# EAGLE design Startgate Controller-Daughterboard (EAGLE 7.7.0)
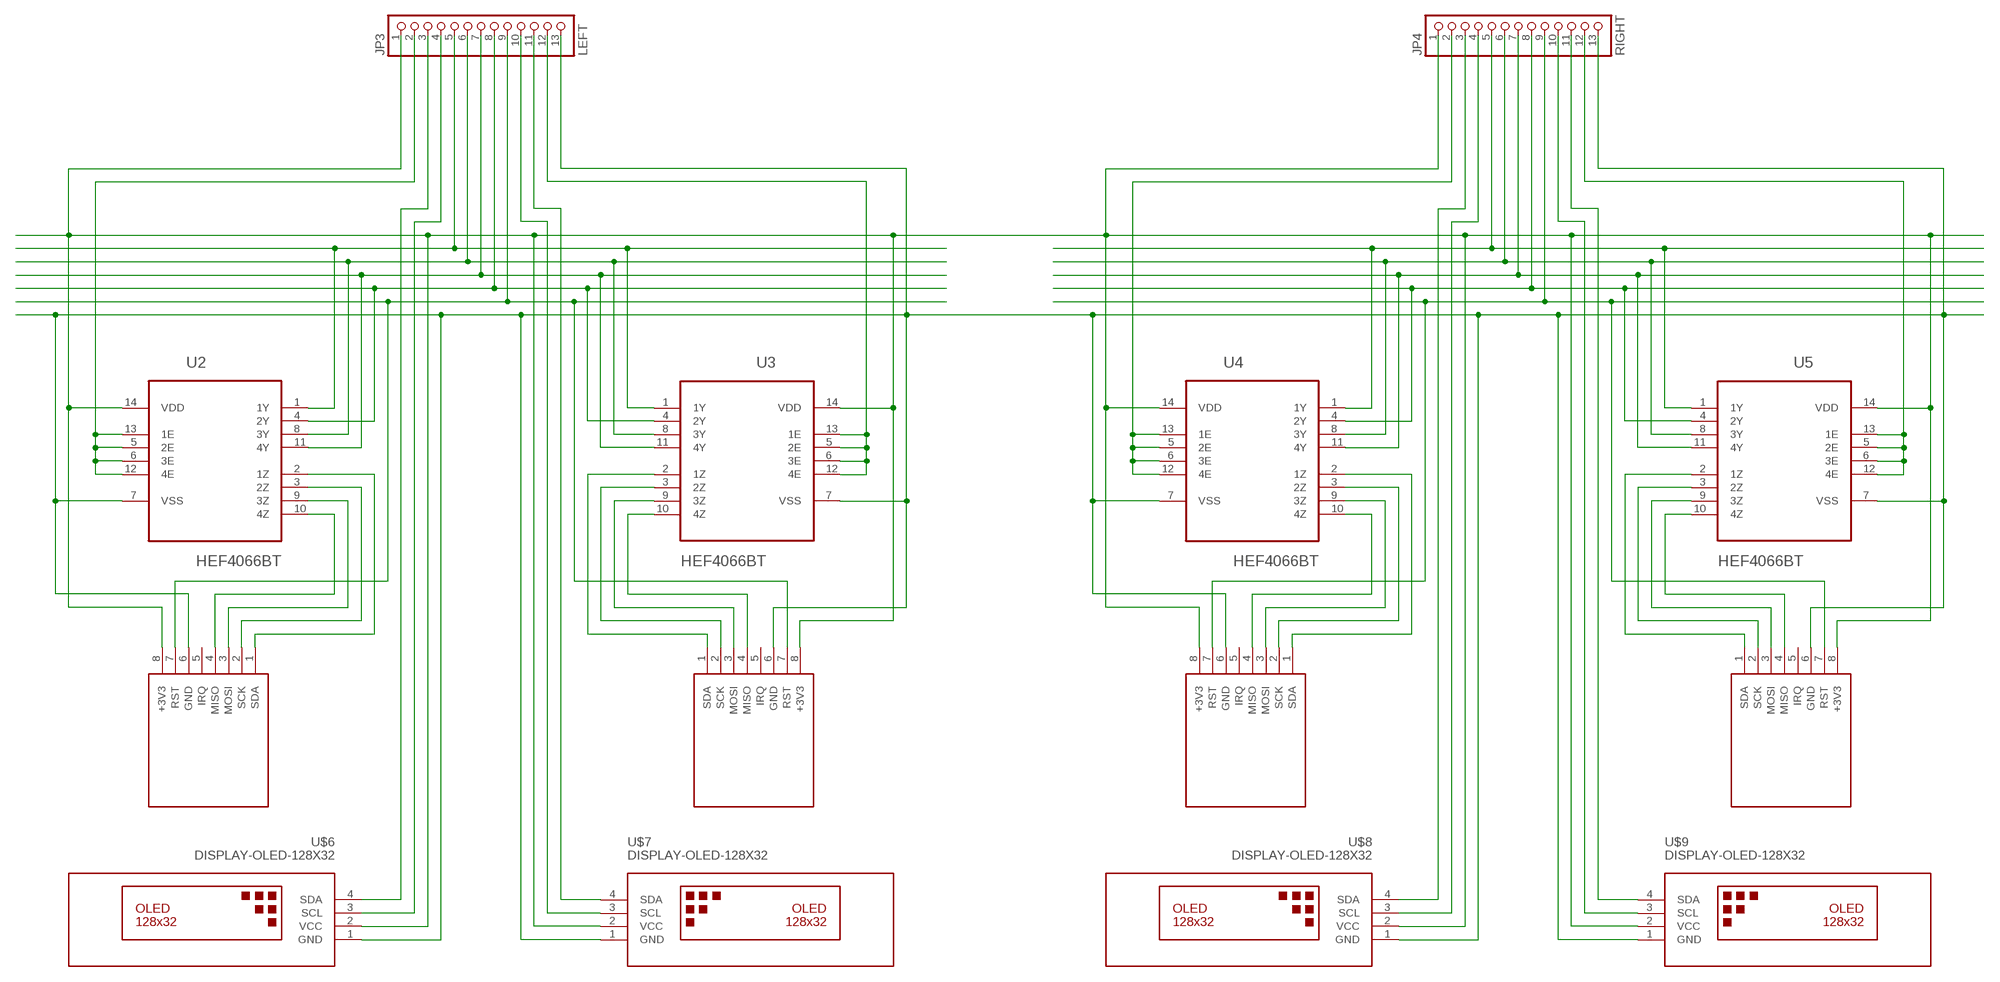
[diagram p0: schematic, sheet 1]

## Parts
JP3  LEFT  PINHD-1X13  [1X13]
JP4  RIGHT  PINHD-1X13  [1X13]
U2  HEF4066BT  [SOIC127P600X175-14N]
U3  HEF4066BT  [SOIC127P600X175-14N]
U4  HEF4066BT  [SOIC127P600X175-14N]
U5  HEF4066BT  [SOIC127P600X175-14N]
U$2  RFID-RC522  [RFID-RC522]
U$3  RFID-RC522  [RFID-RC522]
U$4  RFID-RC522  [RFID-RC522]
U$5  RFID-RC522  [RFID-RC522]
U$6  DISPLAY-OLED-128X32  [DISPLAY-OLED-128X32]
U$7  DISPLAY-OLED-128X32  [DISPLAY-OLED-128X32]
U$8  DISPLAY-OLED-128X32  [DISPLAY-OLED-128X32]
U$9  DISPLAY-OLED-128X32  [DISPLAY-OLED-128X32]

## Nets
+3V3: JP3.1 JP4.1 U2.14(VDD) U3.14(VDD) U4.14(VDD) U5.14(VDD) U$2.8(+3V3) U$3.8(+3V3) U$4.8(+3V3) U$5.8(+3V3) U$6.2(VCC) U$7.2(VCC) U$8.2(VCC) U$9.2(VCC)
ENA1: JP3.2 U2.5(2E) U2.6(3E) U2.12(4E) U2.13(1E)
ENA2: JP3.12 U3.5(2E) U3.6(3E) U3.12(4E) U3.13(1E)
ENA3: JP4.2 U4.5(2E) U4.6(3E) U4.12(4E) U4.13(1E)
GND: JP3.13 JP4.13 U2.7(VSS) U3.7(VSS) U4.7(VSS) U5.7(VSS) U$2.6(GND) U$3.6(GND) U$4.6(GND) U$5.6(GND) U$6.1(GND) U$7.1(GND) U$8.1(GND) U$9.1(GND)
MISO: JP4.7 U4.11(4Y) U5.11(4Y)
MISO-OUT1: U2.10(4Z) U$2.4(MISO)
MISO-OUT2: U3.10(4Z) U$3.4(MISO)
MISO-OUT3: U4.10(4Z) U$4.4(MISO)
MISO-OUT4: U5.10(4Z) U$5.4(MISO)
MOSI: JP4.6 U4.8(3Y) U5.8(3Y)
MOSI-OUT1: U2.9(3Z) U$2.3(MOSI)
MOSI-OUT2: U3.9(3Z) U$3.3(MOSI)
MOSI-OUT3: U4.9(3Z) U$4.3(MOSI)
MOSI-OUT4: U5.9(3Z) U$5.3(MOSI)
N$3: JP3.6 U2.8(3Y) U3.8(3Y)
N$7: JP3.5 U2.1(1Y) U3.1(1Y)
N$8: JP3.7 U2.11(4Y) U3.11(4Y)
N$14: JP3.8 U2.4(2Y) U3.4(2Y)
N$16: JP3.9 U$2.7(RST) U$3.7(RST)
N$41: JP4.12 U5.5(2E) U5.6(3E) U5.12(4E) U5.13(1E)
RST: JP4.9 U$4.7(RST) U$5.7(RST)
SCK: JP4.8 U4.4(2Y) U5.4(2Y)
SCK-OUT1: U2.3(2Z) U$2.2(SCK)
SCK-OUT2: U3.3(2Z) U$3.2(SCK)
SCK-OUT3: U4.3(2Z) U$4.2(SCK)
SCK-OUT4: U5.3(2Z) U$5.2(SCK)
SCL1: JP3.4 U$6.3(SCL)
SCL2: JP3.10 U$7.3(SCL)
SCL3: JP4.4 U$8.3(SCL)
SCL4: JP4.10 U$9.3(SCL)
SDA1: JP3.3 U$6.4(SDA)
SDA2: JP3.11 U$7.4(SDA)
SDA3: JP4.3 U$8.4(SDA)
SDA4: JP4.11 U$9.4(SDA)
SS: JP4.5 U4.1(1Y) U5.1(1Y)
SS-OUT1: U2.2(1Z) U$2.1(SDA)
SS-OUT2: U3.2(1Z) U$3.1(SDA)
SS-OUT3: U4.2(1Z) U$4.1(SDA)
SS-OUT4: U5.2(1Z) U$5.1(SDA)
Unconnected: U$2.5(IRQ) U$3.5(IRQ) U$4.5(IRQ) U$5.5(IRQ)

## Library data of the parts
JP3 JP4 = pinhead:PINHD-1X13: PIN HEADER
U2-U5 = NXP_By_element14_Batch_1:HEF4066BT: Quad single-pole single-throw analog switch; MPN: HEF4066BT; OC_FARNELL: 1085287; OC_NEWARK: 97K1294; PACKAGE: SOIC-14; SUPPLIER: NXP
U$2-U$5 = miro:RFID-RC522: RC522 is a simple, low cost RFID reader module.
U$6-U$9 = diy-modules:DISPLAY-OLED-128X32: 128x32 Dot Matrix OLED Module with I2C interface based on SSD1306 chip More details available here: http://www.tinyosshop.com/index.php?route=product/product&product_id=953 Schematic available here: http://www.tinyosshop.com/datasheet/OLED%2012832.pdf SSD1306 datasheet: https://cdn-shop.adafruit.com/datasheets/SSD1306.pdf Click here to find device on ebay.com <http://www.ebay.com/sch/oled+display+128x32+i2c>

## Board
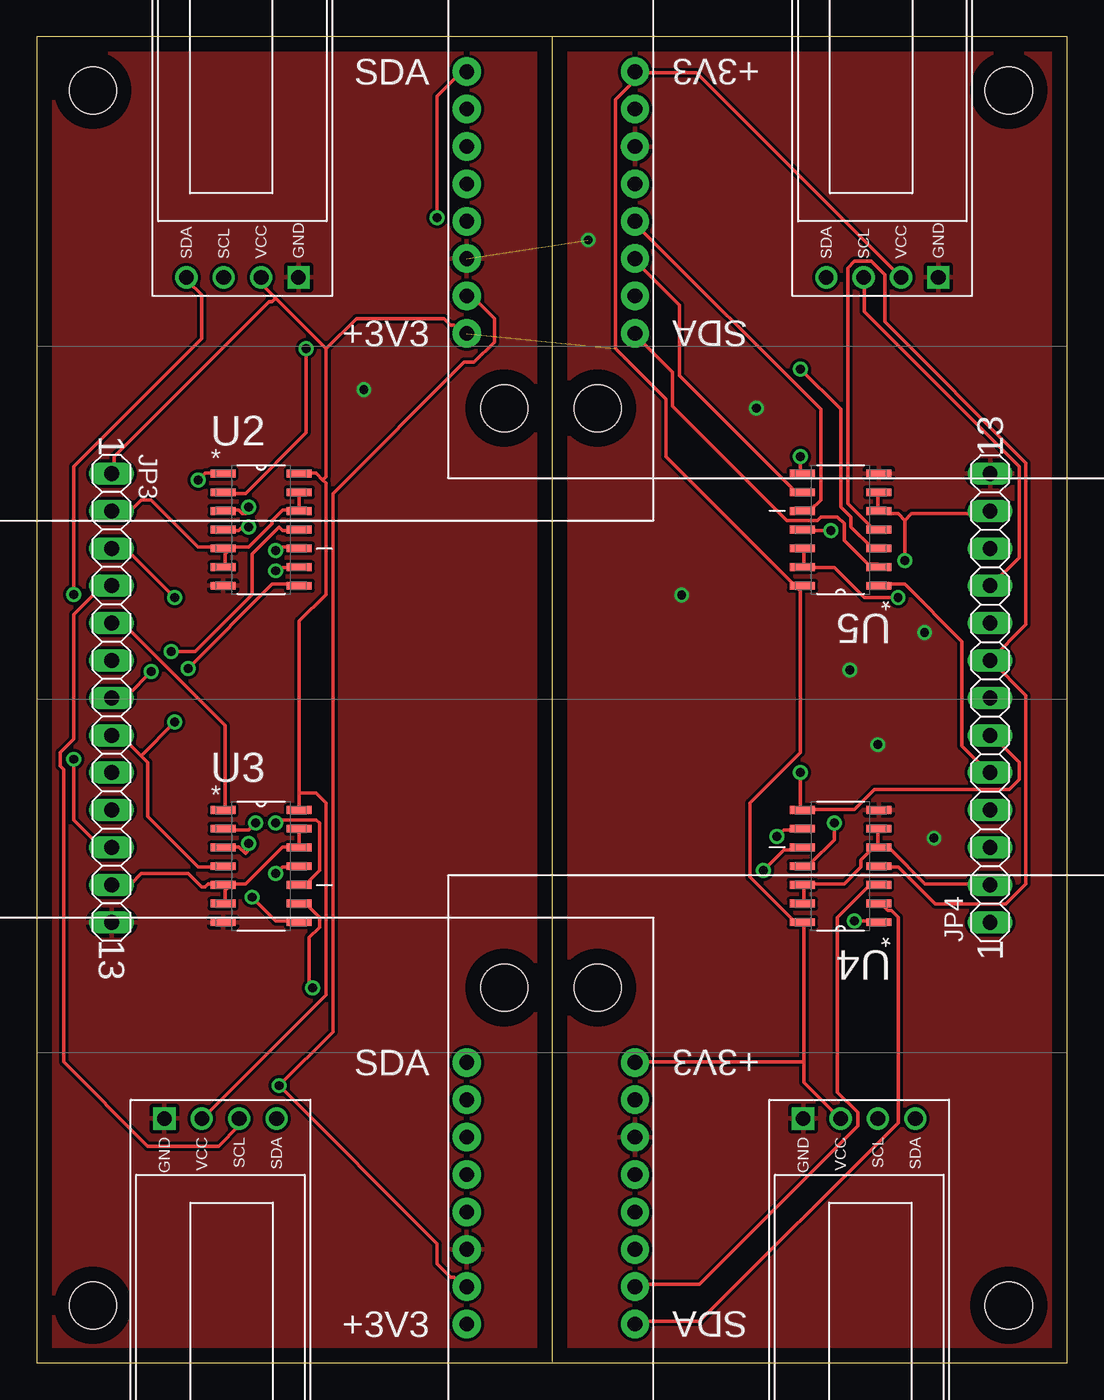
[diagram p1: board, top side]
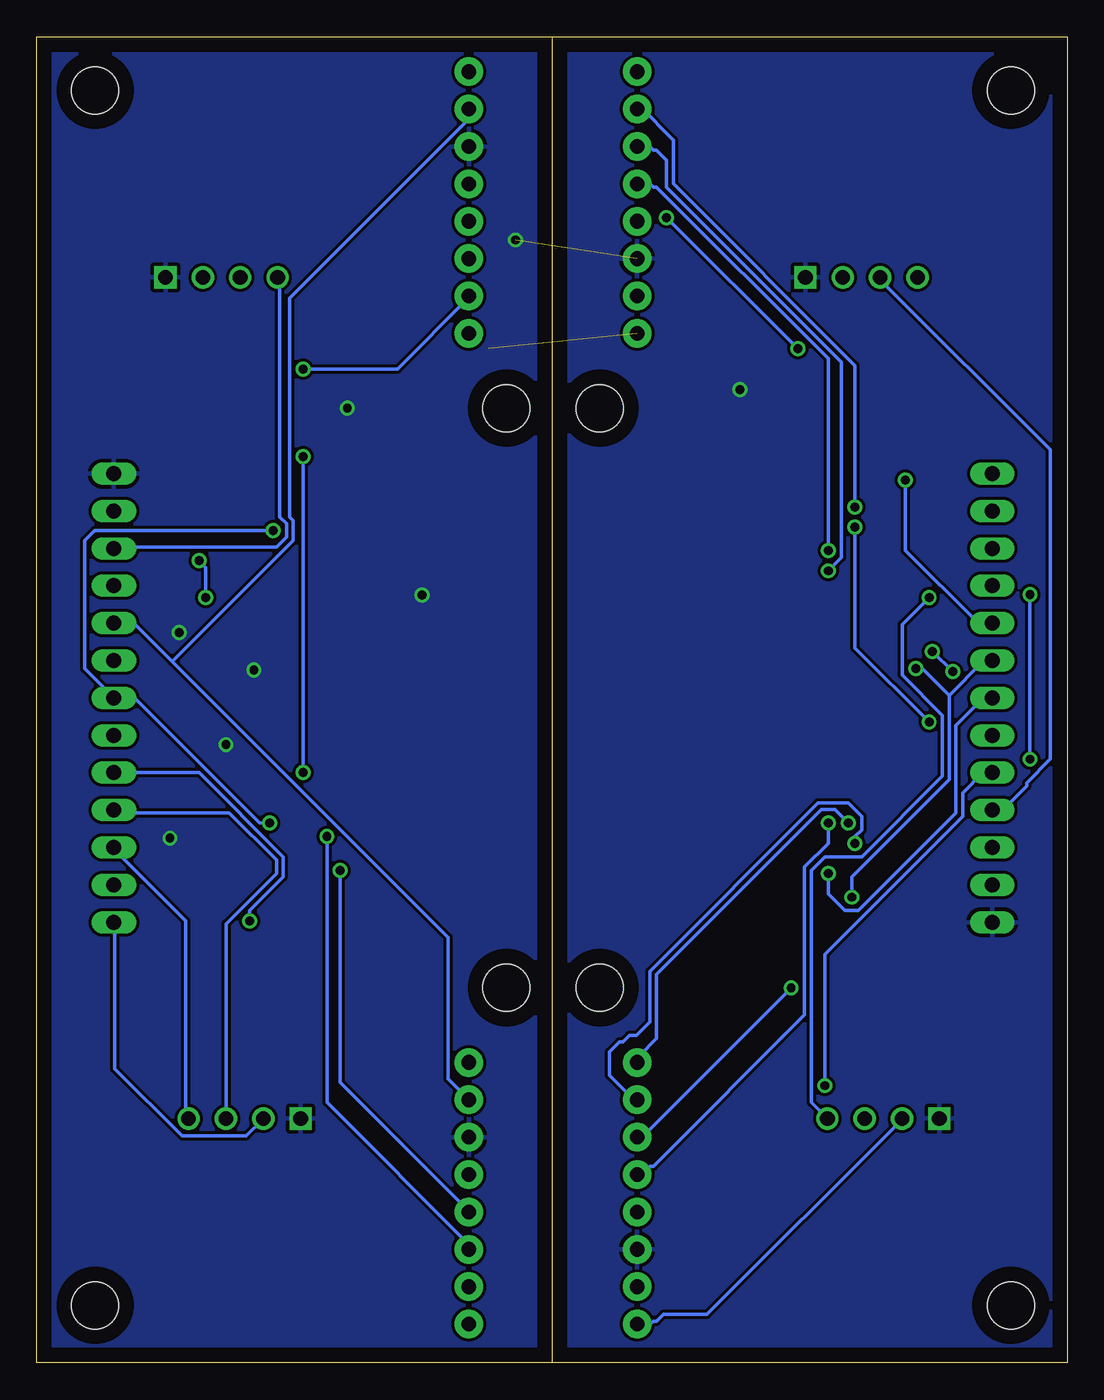
[diagram p2: board, bottom side, seen from below]

Size 70 x 90.08 mm. Coordinates in mm from the lower left corner, seen from the top.
Outline: 35,90.08 35,0.08
Outline: 0,0 70,0 70,90.08 0,90.08 0,0
Copper layers (1*16): Top 0.035mm / dielectric 1.5mm / Bottom 0.035mm
Design rules "default": minimum track width 10mil, minimum drill 24mil, track to track 8mil, track to pad 8mil, pad to pad 8mil, via to via 8mil, smd to smd 8mil, copper to edge 40mil, drill to drill 8mil, minimum pad ring 10mil, minimum via ring 8mil, stop-mask expansion 4mil, vias tented up to drill 0mil, thermal gap 10mil
Holes 3.2 mm at 31.75,64.85 31.75,25.48 3.81,3.89 3.81,86.44 66.04,86.44 38.1,64.85 38.1,25.48 66.04,3.89

### Footprints (pad centres in the part's own frame; a part is rotated, then mirrored left to right if it is on the bottom)
1X13 = drill 1.016 long: 1 -15.24,0; 2 -12.7,0; 3 -10.16,0; 4 -7.62,0; 5 -5.08,0; 6 -2.54,0; 7 0,0; 8 2.54,0; 9 5.08,0; 10 7.62,0; 11 10.16,0; 12 12.7,0; 13 15.24,0
SOIC127P600X175-14N = smd 1.702 x 0.533: 1 -2.591,3.81; 2 -2.591,2.54; 3 -2.591,1.27; 4 -2.591,0; 5 -2.591,-1.27; 6 -2.591,-2.54; 7 -2.591,-3.81; 8 2.591,-3.81; 9 2.591,-2.54; 10 2.591,-1.27; 11 2.591,0; 12 2.591,1.27; 13 2.591,2.54; 14 2.591,3.81
RFID-RC522 = drill 1 pad 1.93: 1 12.7,1.27; 2 15.24,1.27; 3 17.78,1.27; 4 20.32,1.27; 5 22.86,1.27; 6 25.4,1.27; 7 27.94,1.27; 8 30.48,1.27
DISPLAY-OLED-128X32 = drill 1 square: 1 -17.78,-3.81 | drill 1: 2 -17.78,-1.27; 3 -17.78,1.27; 4 -17.78,3.81

### Placement (x,y rotation side)
JP3  5.08,45.16 270 top
JP4  64.77,45.16 90 top
U2  15.24,56.59 0 top
U3  15.24,33.73 0 top
U4  54.61,33.73 180 top
U5  54.61,56.59 180 top
U$2  27.94,100.41 270 top
U$3  27.94,33.1 270 top
U$4  41.91,-10.08 90 top
U$5  41.91,57.23 90 top
U$6  12.48,-1.19 270 top
U$7  13.97,91.52 90 top
U$8  55.88,-1.19 270 top
U$9  57.45,91.52 90 top

### Tracks (layer width: path | path; a pad name or v marks a point on that pad's centre or on a via)
+3V3  (1 unrouted)
  Top 0.254: 17.83,38.71 17.83,50.37 19.66,52.2 19.66,59.74 19.43,59.97 | 17.83,38.71 U3.14 | 19.43,59.97 18.97,60.43 17.83,60.43 U2.14 | 19.66,68.89 16.23,72.32 | 16.23,72.32 15.32,73.23 15.32,73.69 U$7.2 | 19.66,68.89 19.66,60.2 19.43,59.97 | 16.23,72.32 16,72.09 15.77,72.09 5.26,61.57 5.26,60.43 JP3.1 | 19.66,68.89 21.72,70.95 27.66,70.95 28.12,70.49 28.35,70.49 28.8,70.03 29.03,70.03 U$2.8 | 17.83,38.71 18.97,38.71 19.66,38.03 19.66,25 11.43,16.77 U$6.2 | U$9.2 58.52,73.92 44.81,87.63 40.69,87.63 U$5.8 40.46,87.63 40.46,86.95 39.32,85.8 39.32,68.89 42.75,65.46 42.75,61.57 51.89,52.43 | 52.12,20.42 52.12,19.05 54.41,16.77 U$8.2 | 52.12,20.42 52.12,29.8 U4.14 51.89,30.03 51.44,30.03 48.46,33 48.46,38.03 51.89,41.46 51.89,52.43 | 51.89,52.43 51.89,52.66 U5.14 | 52.12,20.42 40.69,20.42 U$4.8
  Bottom 0.254: U$6.2 11.43,16.54 11.43,16.31 24.46,3.28 27.43,3.28 27.89,2.82 28.12,2.82 28.35,2.6 29.03,2.6 U$3.8 | JP4.1 64.69,29.8 64.69,19.97 60.12,15.4 55.78,15.4 54.63,16.54 U$8.2
ENA1
  Top 0.254: 13.03,55.4 13.03,55.17 12.8,54.94 12.8,54.26 U2.6 | 13.03,55.4 12.8,55.4 U2.5 | 17.83,57.92 17.83,58.83 17.6,59.06 17.83,59.29 U2.13 | 13.03,55.4 14.4,55.4 16,57 16,57.23 16.69,57.92 17.83,57.92 | 13.03,55.4 U2.5 | 17.83,57.92 U2.12 | JP3.2 5.26,57.92 6.4,57.92 7.09,58.6 7.77,58.6 10.97,55.4 12.57,55.4 U2.5
ENA2
  Top 0.254: 13.03,32.54 13.03,32.31 12.8,32.08 12.8,31.4 U3.6 | 13.03,32.54 12.8,32.54 U3.5 | 17.83,35.06 17.83,35.97 17.6,36.2 17.83,36.43 U3.13 | 13.03,32.54 14.17,32.54 16.69,35.06 17.83,35.06 | 13.03,32.54 U3.5 | 17.83,35.06 U3.12 | JP3.12 5.26,32.54 6.4,32.54 7.09,33.23 10.29,33.23 11.2,32.31 11.43,32.31 11.66,32.54 12.57,32.54 U3.5
ENA3
  Top 0.254: U4.13 52.12,31.4 52.12,32.31 U4.12 52.12,32.54 54.86,32.54 56.01,33.68 56.01,34.14 57.15,35.28 | 57.15,35.28 57.15,36.2 U4.6 | 57.15,35.28 57.15,35.06 U4.5 57.38,34.83 58.06,34.83 60.35,32.54 64.69,32.54 JP4.2
GND  (via drill 0.6)  (1 unrouted)
  Top 0.254: 40.92,82.61 U$5.6
  other vias: 60.96,35.64 57.15,41.99 60.33,49.61 55.24,47.07 22.23,66.12 48.9,64.85 43.81,52.15 37.47,76.28
  pour Bottom: 0,90.25 69.85,90.25 69.85,-1.19 0,-1.19
  pour Top: 0,90.25 69.85,90.25 69.85,0.08 0,0.08
MISO  (via drill 0.61)
  Top 0.254: v54.18,36.66 54.18,35.51 52.58,33.91 52.12,33.91 U4.11 | v53.95,56.54 52.12,56.54 U5.11
  Bottom 0.254: v54.18,36.66 54.86,36.66 63.32,45.11 64.69,45.11 JP4.7 64.92,45.34 66.75,47.17 66.75,55.86 66.06,56.54 v53.95,56.54
MISO-OUT1  (via drill 0.61)
  Top 0.254: v16.23,55.17 16.46,55.4 17.83,55.4 U2.10
  Bottom 0.254: v16.23,55.17 16.23,68.2 27.89,79.86 28.12,79.86 28.35,80.09 U$2.4
MISO-OUT2  (via drill 0.61)
  Top 0.254: v16.23,36.66 16.46,36.88 18.97,36.88 19.2,36.66 19.2,33.46 18.29,32.54 17.83,32.54 U3.10
  Bottom 0.254: v16.23,36.66 16.23,35.28 17.83,33.68 17.83,23.63 28.12,13.34 28.35,13.34 29.03,12.65 U$3.4
MISO-OUT3  (via drill 0.61)
  Top 0.254: v49.38,33.46 50.75,34.83 51.89,34.83 U4.10
  Bottom 0.254: v49.38,33.46 49.38,19.05 40.69,10.37 U$4.4
MISO-OUT4
  Top 0.254: U5.10 52.12,57.92 52.58,57.92 53.26,58.6 53.26,64.77 40.69,77.35 U$5.4
MOSI  (via drill 0.61)
  Top 0.254: JP4.6 64.92,42.6 66.75,40.77 66.75,39.63 66.06,38.94 56.92,38.94 55.55,37.57 52.12,37.57 U4.8 51.89,37.57 v51.89,40.09 | v51.89,61.57 51.89,60.43 U5.8
  Bottom 0.254: v51.89,40.09 v51.89,61.57
MOSI-OUT1  (via drill 0.61)
  Top 0.254: v16.23,53.8 16.46,53.8 16.69,54.03 17.83,54.03 U2.9
  Bottom 0.254: v16.23,53.8 15.32,54.71 15.32,67.97 27.2,79.86 27.2,81.69 27.89,82.38 28.12,82.38 28.35,82.61 29.03,82.61 U$2.3
MOSI-OUT2  (via drill 0.61)
  Top 0.254: v18.75,25.45 18.52,25.68 18.52,28.88 19.2,29.57 19.2,30.25 18.29,31.17 17.83,31.17 U3.9
  Bottom 0.254: v18.75,25.45 29.03,15.17 U$3.3
MOSI-OUT3  (via drill 0.61)
  Top 0.254: v50.29,35.74 50.75,36.2 51.89,36.2 U4.9
  Bottom 0.254: v50.29,35.74 50.29,17.68 40.46,7.85 U$4.3
MOSI-OUT4
  Top 0.254: U5.9 51.89,59.29 51.44,59.29 43.66,67.06 43.66,71.86 40.69,74.83 U$5.3
N$3  (via drill 0.61)
  Top 0.254: v14.63,31.63 16.23,30.03 17.83,30.03 U3.8 | v10.29,47.17 16,52.89 17.83,52.89 U2.8
  Bottom 0.254: v14.63,31.63 14.63,33 8,39.63 8,45.34 | 8,45.34 5.71,47.63 5.26,47.63 JP3.6 | v10.29,47.17 9.83,47.17 8,45.34
N$7  (via drill 0.61)
  Top 0.254: U3.1 12.8,37.57 12.8,43.28 5.94,50.14 5.26,50.14 JP3.5 | v10.97,59.97 11.43,60.43 12.57,60.43 U2.1
  Bottom 0.254: v10.97,59.97 10.97,55.17 6.17,50.37 5.26,50.37 JP3.5
N$8  (via drill 0.61)
  Top 0.254: v16.23,33.23 16.69,33.68 17.83,33.68 U3.11 | v9.14,48.31 10.74,48.31 14.63,52.2 14.63,54.94 16.46,56.77 16.69,56.54 17.83,56.54 U2.11 | v7.77,46.94 6.17,45.34 5.26,45.34 JP3.7
  Bottom 0.254: v16.23,33.23 16.23,31.85 15.09,30.71 14.17,30.71 7.54,37.34 7.54,43.28 5.71,45.11 5.26,45.11 JP3.7 | v7.77,46.94 v9.14,48.31
N$14  (via drill 0.61)
  Top 0.254: 7.09,41.23 5.71,42.6 5.26,42.6 JP3.8 | 7.09,41.23 7.54,40.77 7.54,37.11 10.97,33.68 12.57,33.68 U3.4 | v14.4,56.77 14.17,57 13.72,56.54 12.8,56.54 U2.4 | 7.09,41.23 v9.37,43.51
  Bottom 0.254: v14.4,56.77 14.4,48.54 v9.37,43.51
N$16  (via drill 0.61)
  Top 0.254: U$3.7 29.03,5.11 28.35,5.79 28.12,5.79 27.2,6.71 27.2,8.08 v16.46,18.82 20.12,22.48 20.12,59.06 29.03,67.97 29.72,67.97 31.09,69.35 31.09,70.95 29.72,72.32 29.26,72.32 U$2.7
  Bottom 0.254: JP3.9 5.71,40.09 7.09,38.71 7.09,37.11 16.46,27.74 v16.46,18.82
N$41  (via drill 0.61)
  Top 0.254: U5.12 52.12,55.17 52.12,54.26 U5.13 52.12,54.03 54.18,54.03 56.24,51.97 v58.52,51.97 | U5.6 57.15,59.06 57.15,57.92 U5.5 57.38,57.69 58.52,57.69 58.98,57.23 | 58.98,57.23 v58.98,54.49 | 58.98,57.23 59.44,57.69 64.69,57.69 JP4.12
  Bottom 0.254: v58.52,51.97 58.52,54.03 v58.98,54.49
RST
  Bottom 0.254: 60.81,47.63 42.06,28.88 42.06,19.28 U$4.7 | 60.81,47.63 63.32,50.14 64.69,50.14 JP4.9 | 60.81,47.63 52.58,55.86 52.58,57.23 52.81,57.46 52.81,72.32 40.69,84.43 40.69,85.12 U$5.7
SCK
  Top 0.254: U4.4 57.38,33.68 58.52,33.68 61.04,31.17 65.84,31.17 67.21,32.54 67.21,45.34 64.92,47.63 JP4.8 67.21,50.14 67.21,61.12 57.61,70.72 57.61,73.92 56.69,74.83 55.55,74.83 55.09,74.38 55.09,58.37 56.69,56.77 57.15,56.77 U5.4
SCK-OUT1  (via drill 0.61)
  Top 0.254: v14.4,58.14 14.4,57.92 14.17,57.69 13.95,57.69 13.72,57.92 12.8,57.92 U2.3
  Bottom 0.254: v14.4,58.14 14.4,67.75 26.75,80.09 26.75,83.06 29.03,85.35 U$2.2
SCK-OUT2  (via drill 0.61)
  Top 0.254: v14.4,35.28 14.4,34.83 14.17,34.6 13.72,35.06 12.8,35.06 U3.3
  Bottom 0.254: v14.4,35.28 14.4,35.74 13.95,36.2 13.95,37.11 14.86,38.03 16.92,38.03 28.35,26.6 28.35,23.17 29.26,22.25 29.72,22.25 30.18,21.8 30.4,21.8 31.09,21.11 31.09,19.51 29.26,17.68 U$3.2
SCK-OUT3
  Top 0.254: U4.3 57.15,32.31 56.46,32.31 54.41,30.25 54.41,18.37 55.78,17 55.78,16.08 45.03,5.34 40.69,5.34 U$4.2
SCK-OUT4  (via drill 0.61)
  Top 0.254: v51.89,67.52 54.63,64.77 54.63,58.14 55.32,57.46 55.32,56.77 56.69,55.4 57.15,55.4 U5.3
  Bottom 0.254: v51.89,67.52 45.49,67.52 40.69,72.32 U$5.2
SCL1
  Top 0.254: U$6.3 13.72,16.54 13.72,16.08 12.34,14.71 7.54,14.71 1.83,20.42 1.83,40.31 1.6,40.54 1.6,41.46 2.52,42.37 2.52,50.83 4.34,52.66 5.03,52.66 JP3.4
SCL2
  Bottom 0.254: U$7.3 12.57,73.69 12.57,73.46 1.14,62.03 1.14,41 2.74,39.4 2.74,39.17 4.34,37.57 5.03,37.57 JP3.10
SCL3
  Bottom 0.254: U$8.3 57.15,29.8 53.72,33.23 53.72,34.14 56.92,37.34 64.69,37.34 JP4.4
SCL4
  Top 0.254: U$9.3 56.24,73.69 56.24,71.4 66.75,60.89 66.75,54.71 64.92,52.89 JP4.10
SDA1  (via drill 0.61)
  Top 0.254: v9.37,51.97 6.17,55.17 5.26,55.17 JP3.3
  Bottom 0.254: v9.37,51.97 11.2,50.14 11.2,46.71 8.46,43.97 8.46,39.86 13.95,34.37 16.46,34.37 17.37,33.46 17.37,17.68 16.46,16.77 U$6.4
SDA2  (via drill 0.61)
  Top 0.254: v2.52,52.2 2.52,60.89 11.2,69.57 11.2,72.55 10.29,73.46 10.29,73.69 U$7.4 | v2.52,41 2.52,36.88 4.34,35.06 5.03,35.06 JP3.11
  Bottom 0.254: v2.52,41 v2.52,52.2
SDA3
  Bottom 0.254: U$8.4 59.89,16.77 59.89,30.03 64.69,34.83 JP4.3
SDA4
  Bottom 0.254: U$9.4 53.49,73.69 53.49,57.46 53.03,57 53.03,56.09 53.72,55.4 64.69,55.4 JP4.11
SS  (via drill 0.61)
  Top 0.254: v55.55,30.03 57.15,30.03 U4.1 | U5.1 57.38,52.89 58.98,52.89 62.87,49 62.87,41.91 64.69,40.09 JP4.5
  Bottom 0.254: v55.55,30.03 55.55,30.71 53.26,33 53.26,34.37 58.98,40.09 JP4.5
SS-OUT1  (via drill 0.61)
  Top 0.254: v18.29,68.89 18.29,63.17 14.17,59.06 12.8,59.06 U2.2 | v27.2,77.8 27.2,86.03 29.03,87.86 U$2.1
  Bottom 0.254: v27.2,77.8 v18.29,68.89
SS-OUT2  (via drill 0.61)
  Top 0.254: v14.86,36.66 14.4,36.2 12.8,36.2 U3.2
  Bottom 0.254: v14.86,36.66 15.77,37.57 16.69,37.57 27.89,26.37 27.89,22.03 29.03,20.88 29.03,20.42 U$3.1
SS-OUT3
  Top 0.254: U4.2 57.38,31.17 57.84,30.71 58.06,30.71 58.52,30.25 58.52,16.31 45.03,2.82 40.69,2.82 U$4.1
SS-OUT4
  Top 0.254: U5.2 57.15,54.26 56.46,54.26 54.86,55.86 54.86,57 54.41,57.46 53.26,57.46 53.03,57.23 50.98,57.23 43.2,65 43.2,67.29 40.69,69.8 U$5.1

### Text on the board
tNames: SDA | +3V3 | +3V3 | SDA | 13 | 1 | 1 | 13 | SDA | +3V3 | +3V3 | SDA